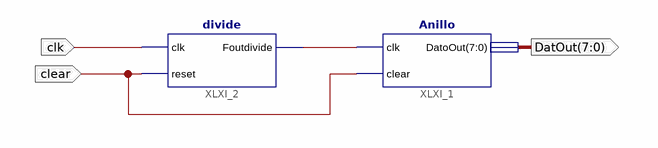
[diagram p0: schematic sheet 1]
// Xilinx ISE schematic SuperiorAnillo.sch (spartan6) as structural Verilog: 2 symbols, 3 ports
module SuperiorAnillo (
  input  clk,
  input  clear,
  output [7:0] DatOut
);

  wire XLXN_4;

  Anillo XLXI_1 (.clk(XLXN_4), .clear(clear), .DatoOut(DatOut));
  divide XLXI_2 (.clk(clk), .reset(clear), .Foutdivide(XLXN_4));
endmodule
